# EAGLE design I2C-8574 (EAGLE 7.7.0)
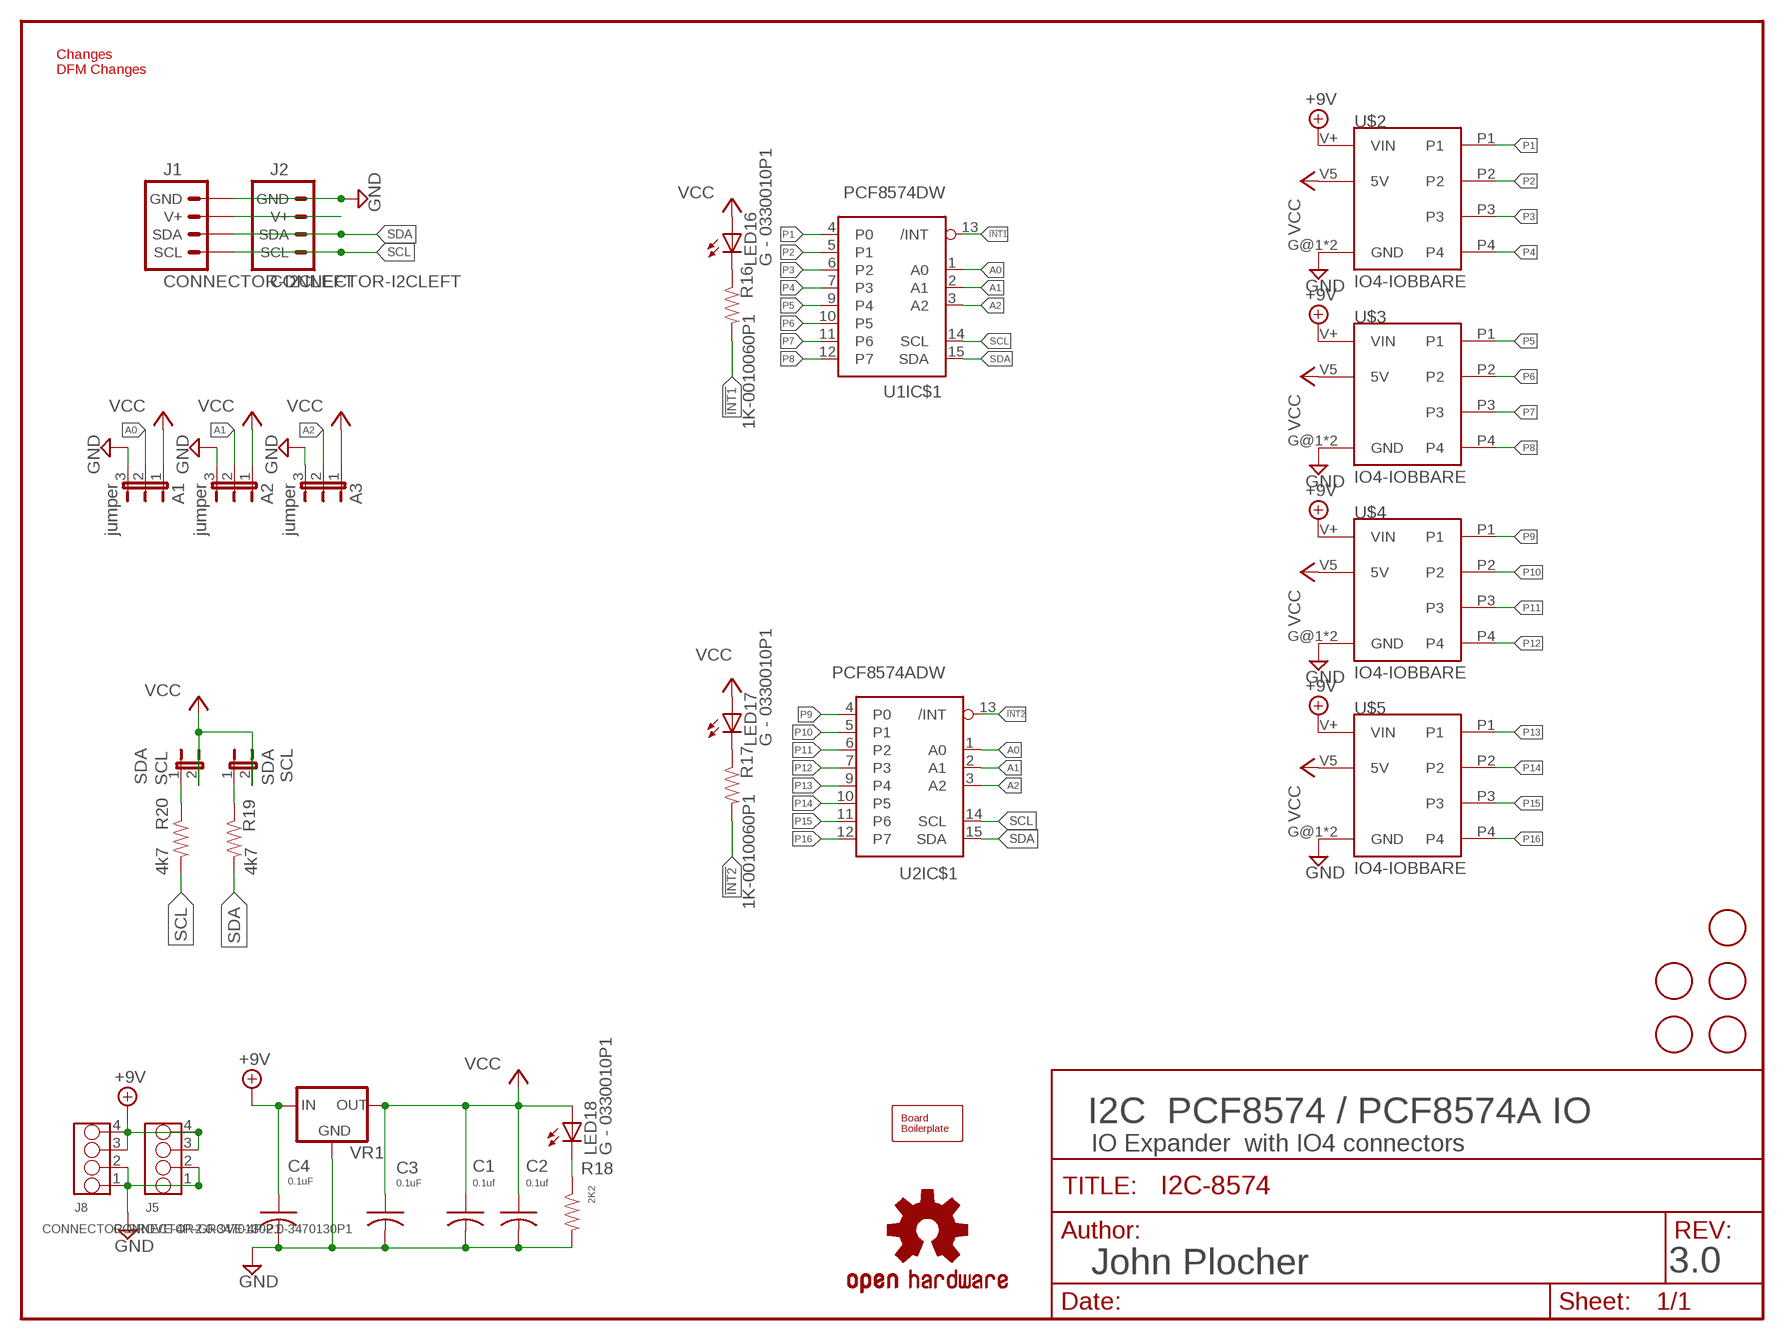
[diagram p0: schematic, sheet 1]

## Parts
A1  jumper  JUMPER-3PTH-LOCK  [1X03]
A2  jumper  JUMPER-3PTH-LOCK  [1X03]
A3  jumper  JUMPER-3PTH-LOCK  [1X03]
BOARD1  BOARD80X100-NOHOLES  [BOARD-DINRAIL-3.17IN-NOHOLES]
C1  0.1uf  C0805  [0805-CAP]
C2  0.1uf  C0805  [0805-CAP]
C3  0.1uF  C0805  [0805-CAP]
C4  0.1uF  C0805  [0805-CAP]
FID1  FIDUCIAL  [FIDUCIAL_1MM]
FID2  FIDUCIAL  [FIDUCIAL_1MM]
FID3  FIDUCIAL  [FIDUCIAL_1MM]
FID-U1  FIDUCIAL  [FIDUCIAL_1MM]
FID-U2  FIDUCIAL  [FIDUCIAL_1MM]
J1  CONNECTOR-I2CLEFT  [I2C-L]
J2  CONNECTOR-I2CLEFT  [I2C-L]
J5  CONNECTOR-GROVE-4P-2.0-3470130P1  [4P-2.0]
J8  CONNECTOR-GROVE-4P-2.0-3470130P1  [4P-2.0]
LED16  G - 0330010P1  LED0603-LED  [0603-LED]
LED17  G - 0330010P1  LED0603-LED  [0603-LED]
LED18  G - 0330010P1  LED0603-LED  [0603-LED]
R16  1K-0010060P1  R0805-RES  [0805-RES]
R17  1K-0010060P1  R0805-RES  [0805-RES]
R18  2K2  R0805-RES  [0805-RES]
R19  4k7  R0805-RES  [0805-RES]
R20  4k7  R0805-RES  [0805-RES]
SCL  SDA  JUMPER-2PTH_LOCK  [1X02_LOCK]
SDA  SCL  JUMPER-2PTH_LOCK  [1X02_LOCK]
U1  PCF8574DW  [SO-16DW]
U2  PCF8574ADW  [SO-16DW]
U$1  OSHW-LOGOL  [OSHW-LOGO-L]
U$2  IO4-IOBBARE  [IO4-IOB]
U$3  IO4-IOBBARE  [IO4-IOB]
U$4  IO4-IOBBARE  [IO4-IOB]
U$5  IO4-IOBBARE  [IO4-IOB]
VR1  VREG-DPAK-5  [TO-252]

## Nets
!INT1 [signals]: R16.2 U1.13(IC$1:/INT)
!INT2 [signals]: R17.2 U2.13(IC$1:/INT)
+9V [Power]: C4.1 J5.3 J5.4 J8.3 J8.4 U$2.V+(VIN) U$3.V+(VIN) U$4.V+(VIN) U$5.V+(VIN) VR1.1(IN)
A0 [signals]: A1.2 U1.1(IC$1:A0) U2.1(IC$1:A0)
A1 [signals]: A2.2 U1.2(IC$1:A1) U2.2(IC$1:A1)
A2 [signals]: A3.2 U1.3(IC$1:A2) U2.3(IC$1:A2)
GND [Power]: A1.3 A2.3 A3.3 C1.2 C2.2 C3.2 C4.2 J1.GND J1.GND@1(GND) J2.GND J2.GND@1(GND) J5.1 J5.2 J8.1 J8.2 R18.2 U$2.G@1(GND) U$2.G@2(GND) U$3.G@1(GND) U$3.G@2(GND) U$4.G@1(GND) U$4.G@2(GND) U$5.G@1(GND) U$5.G@2(GND) VR1.2(GND)
N$1: LED18.C R18.1
N$19 [signals]: R19.1 SCL.1
N$20 [signals]: R20.1 SDA.1
N$37: LED17.C R17.1
N$38: LED16.C R16.1
N$39: J1.V+ J1.V+@1(V+) J2.V+ J2.V+@1(V+)
P1 [signals]: U1.4(IC$1:P0) U$2.P1
P2 [signals]: U1.5(IC$1:P1) U$2.P2
P3 [signals]: U1.6(IC$1:P2) U$2.P3
P4 [signals]: U1.7(IC$1:P3) U$2.P4
P5 [signals]: U1.9(IC$1:P4) U$3.P1
P6 [signals]: U1.10(IC$1:P5) U$3.P2
P7 [signals]: U1.11(IC$1:P6) U$3.P3
P8 [signals]: U1.12(IC$1:P7) U$3.P4
P9 [signals]: U2.4(IC$1:P0) U$4.P1
P10 [signals]: U2.5(IC$1:P1) U$4.P2
P11 [signals]: U2.6(IC$1:P2) U$4.P3
P12 [signals]: U2.7(IC$1:P3) U$4.P4
P13 [signals]: U2.9(IC$1:P4) U$5.P1
P14 [signals]: U2.10(IC$1:P5) U$5.P2
P15 [signals]: U2.11(IC$1:P6) U$5.P3
P16 [signals]: U2.12(IC$1:P7) U$5.P4
SCL [signals]: J1.SCL J1.SCL@1(SCL) J2.SCL J2.SCL@1(SCL) R20.2 U1.14(IC$1:SCL) U2.14(IC$1:SCL)
SDA [signals]: J1.SDA J1.SDA@1(SDA) J2.SDA J2.SDA@1(SDA) R19.2 U1.15(IC$1:SDA) U2.15(IC$1:SDA)
VCC [Power]: A1.1 A2.1 A3.1 C1.1 C2.1 C3.1 LED16.A LED17.A LED18.A SCL.2 SDA.2 U$2.V5(5V) U$3.V5(5V) U$4.V5(5V) U$5.V5(5V) VR1.3(OUT)

## Notes on the sheet
- Changes
  DFM Changes
- I2C  PCF8574 / PCF8574A IO
- IO Expander  with IO4 connectors
- John Plocher | 3.0

## Power pins joined to a net without a drawn wire
GND: U1.8(PWR:GND) U2.8(PWR:GND)
VCC: U1.16(PWR:VCC) U2.16(PWR:VCC)

## Library data of the parts
A1-A3 = SPCoast-minimal:JUMPER-3
BOARD1 = SPCoast:BOARD
C1-C4 = SPCoast-minimal:C
FID1-FID3 FID-U1 FID-U2 = SPCoast:FIDUCIAL: For use by pick and place machines to calibrate the vision/machine, 1mm By microbuilder.eu
J1 J2 = SPCoast:CONNECTOR-I2C
J5 J8 = SPCoast:CONNECTOR-GROVE-4P-2.0
LED16-LED18 = SPCoast:LED*
R16-R18 = SPCoast-minimal:R*: Resistor Basic schematic elements and footprints for 0603, 1206, and PTH 1/10th watt (small) resistors.
R19 R20 = SPCoast:R*: Resistor Basic schematic elements and footprints for 0603, 1206, and PTH 1/10th watt (small) resistors.
SCL SDA = SPCoast-minimal:JUMPER-2: Jumper Basic 0.1" spaced jumper. Use with breakaway headers.
U1 U2 = SPCoast-minimal:PCF8574: Remote 8-Bit I/O Expander for I²C Bus
U$1 = SparkFun:OSHW-LOGO: Open Source Hardware Logo This logo indicates the piece of hardware it is found on incorporates a OSHW license and/or adheres to the definition of open source hardware found here: http://freedomdefined.org/OSHW
U$2-U$5 = SPCoast:IO4-IOB
VR1 = SPCoast:VREG-?-*: Voltage Regulator Standard linear regulator. 7805 uses IGO pinout LM1117 uses GOI pinout

## Net classes
0 default: width 0.254 mm, drill 0.5 mm
1 Power: width 0.406 mm, drill 0.6 mm
2 signals: width 0.254 mm, drill 0.5 mm

## Board
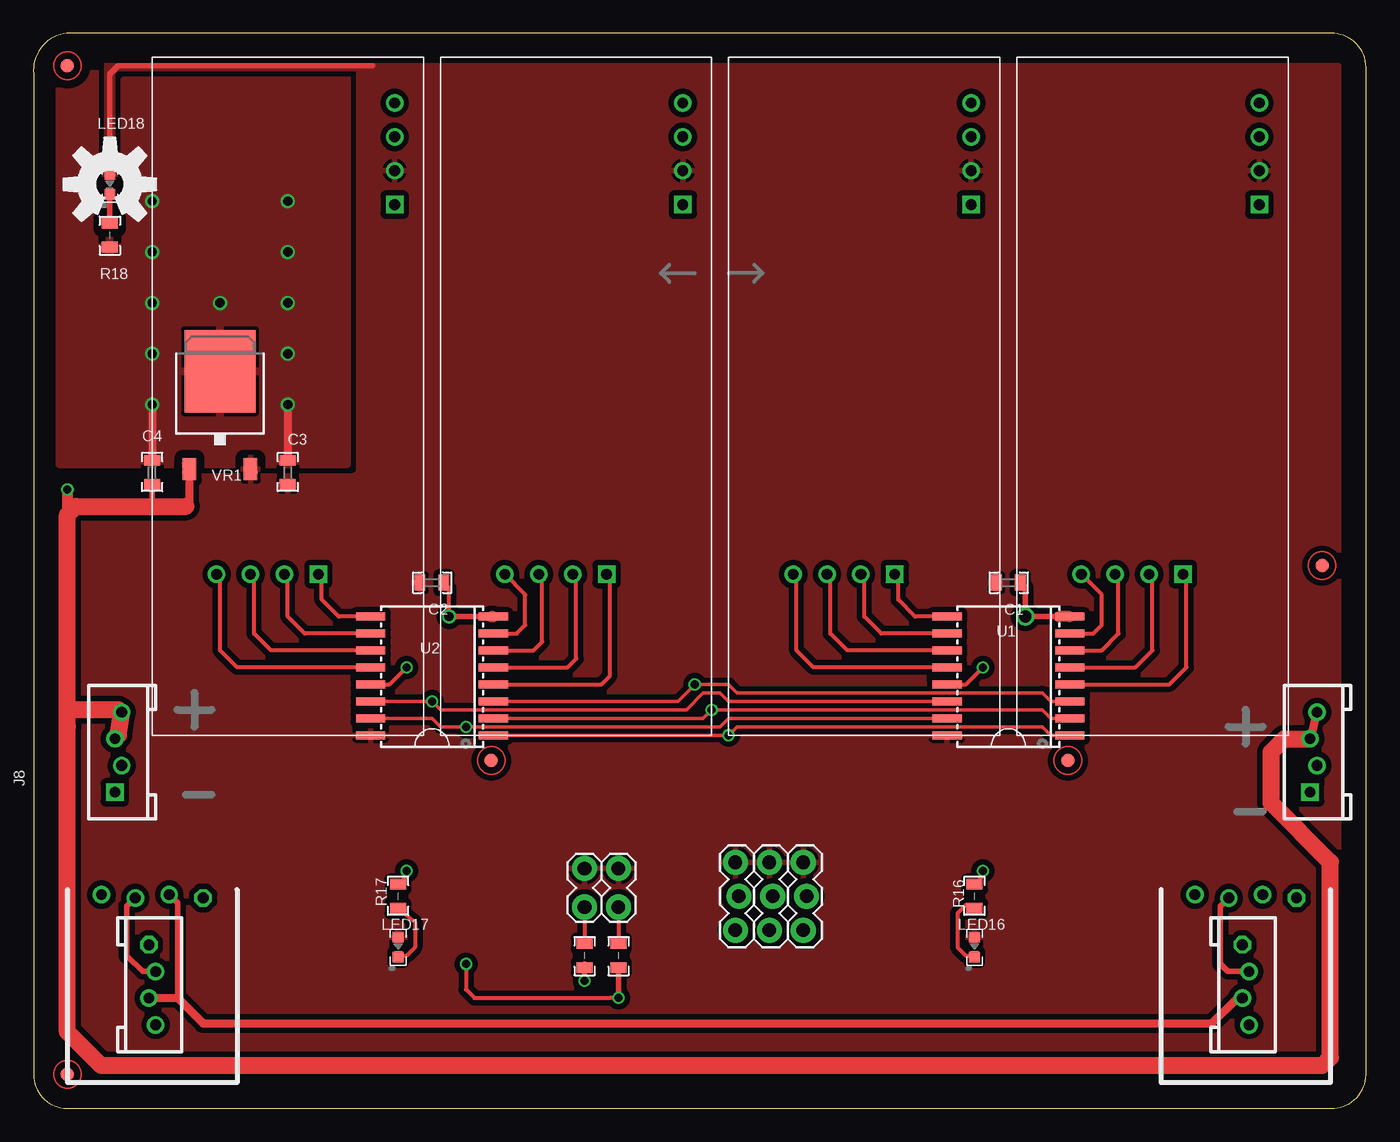
[diagram p1: board, top side]
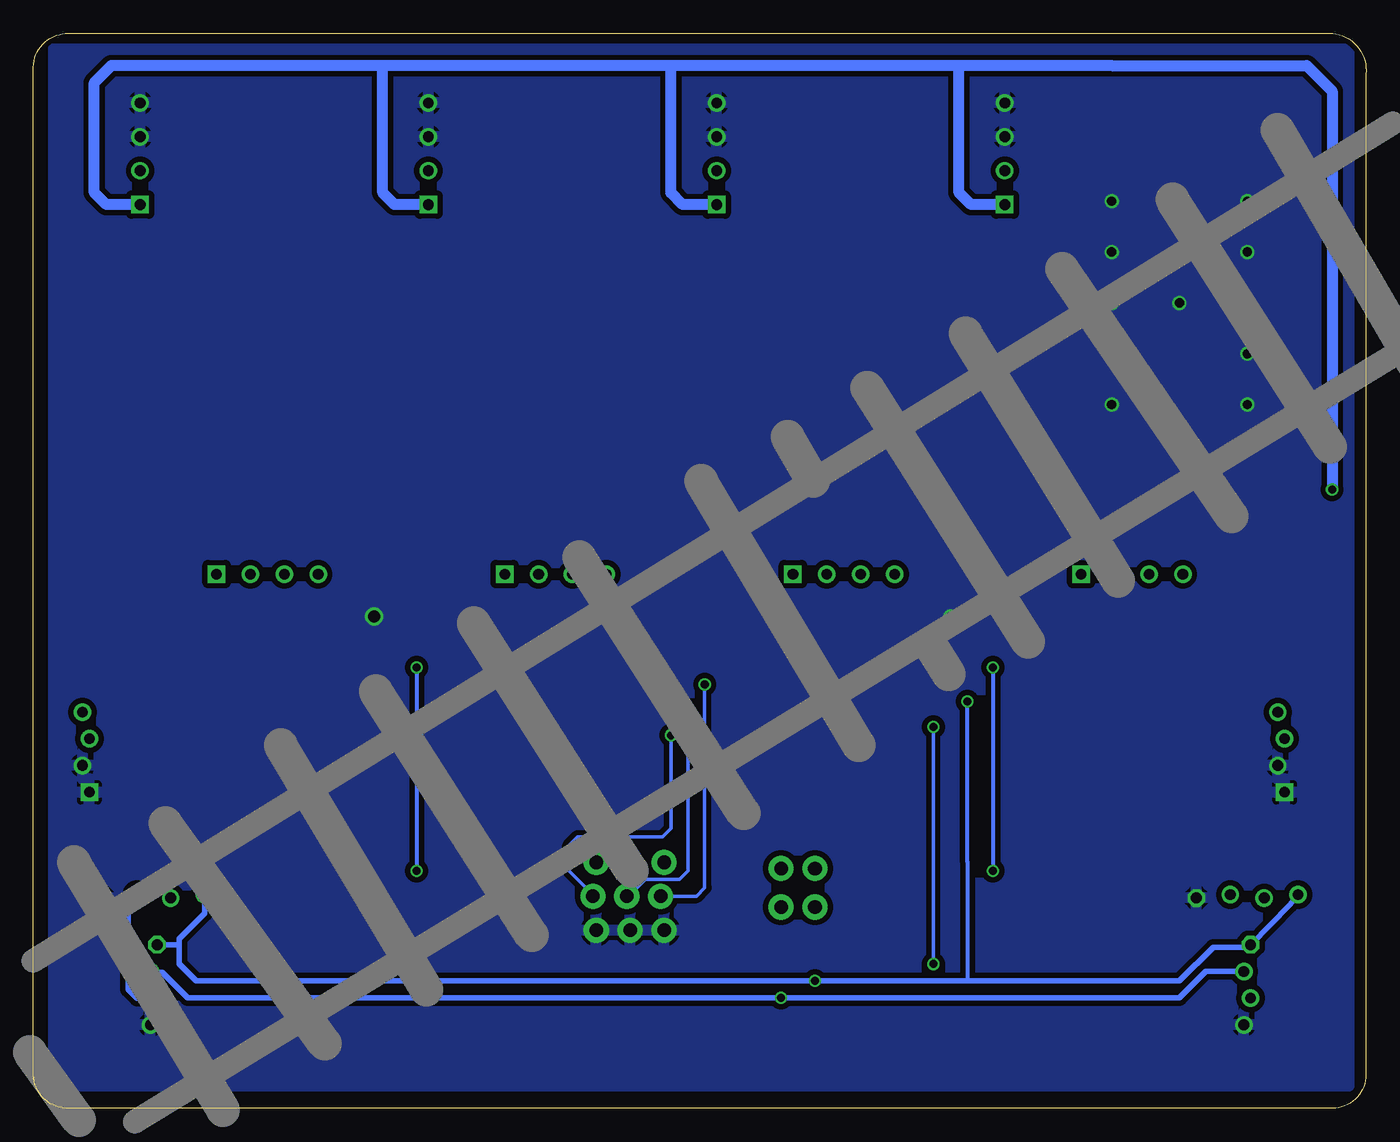
[diagram p2: board, bottom side, seen from below]

Size 99.84 x 80.52 mm. Coordinates in mm from the lower left corner, seen from the top.
Copper layers (1*16): Top 0.035mm / dielectric 1.5mm / Bottom 0.035mm
Design rules "Fusion_eagle_rule_v1.1": minimum track width 6mil, minimum drill 12mil, track to track 6mil, track to pad 6mil, pad to pad 6mil, via to via 6mil, smd to smd 0mil, copper to edge 10mil, drill to drill 10mil, minimum pad ring 10mil, minimum via ring 6mil, stop-mask expansion 2mil, vias tented up to drill 100mil, thermal gap 10mil

### Footprints (pad centres in the part's own frame; a part is rotated, then mirrored left to right if it is on the bottom)
1X03 = drill 1.016 pad 1.88: 1 0,-0.127; 2 2.54,0.127; 3 5.08,-0.127
0805-CAP = smd 0.8 x 1.2: 1 -0.9,0; 2 0.9,0
FIDUCIAL_1MM = smd 1 x 1: 1 0,0
I2C-L = drill 0.8 octagon: GND 3.81,-0.127 | drill 0.8 pad 1.27: GND@1 0.254,-9.635; SDA@1 0.254,-5.635; V+@1 -0.254,-7.635 | drill 0.8: SCL -3.81,0.127; SDA -1.27,-0.127; V+ 1.27,0.127 | drill 0.8 pad 1.27 octagon: SCL@1 -0.254,-3.635
4P-2.0 = drill 0.8 pad 1.27 square: 1 -3,0.254 | drill 0.8 pad 1.27: 2 -1,-0.254; 3 1,0.254; 4 3,-0.254
0603-LED = smd 0.8 x 0.8: A -0.75,0; C 0.75,0
0805-RES = smd 0.8 x 1.2: 1 -0.9,0; 2 0.9,0
1X02_LOCK = drill 1.016 pad 1.88: 1 -0.178,0; 2 2.718,0
SO-16DW = smd 0.6 x 2.2: 1 -4.445,-4.6; 2 -3.175,-4.6; 3 -1.905,-4.6; 4 -0.635,-4.6; 5 0.635,-4.6; 6 1.905,-4.6; 7 3.175,-4.6; 8 4.445,-4.6; 9 4.445,4.6; 10 3.175,4.6; 11 1.905,4.6; 12 0.635,4.6; 13 -0.635,4.6; 14 -1.905,4.6; 15 -3.175,4.6; 16 -4.445,4.6
IO4-IOB = drill 0.8: G@1 5.969,18.161; G@2 3.429,18.161; P2 38.735,9.906; P3 38.735,7.366; P4 38.735,4.826; V5 8.509,18.161 | drill 0.8 square: P1 38.735,12.446; V+ 11.049,18.161
TO-252 = smd 1.016 x 1.651: 1 -2.286,-4.826; 3 2.286,-4.826 | smd 5.3 x 6.2: 2 0,2.5

### Placement (x,y rotation side)
A1  57.8,18.41 270 top
A2  55.26,18.41 270 top
A3  52.72,18.41 270 top
BOARD1  0.01,0 0 top
C1  73.04,39.37 0 top
C2  29.86,39.37 0 top
C3  19.06,47.62 90 top
C4  8.9,47.62 90 top
FID1  2.55,78.11 0 top
FID2  2.55,2.54 0 top
FID3  96.53,40.64 0 top
FID-U1  77.48,26.04 0 top
FID-U2  34.3,26.04 0 top
J1  90.82,15.88 0 top
J2  8.9,15.88 0 top
J5  95.9,26.67 90 top
J8  6.36,26.67 90 top
LED16  70.5,12.06 270 top
LED17  27.32,12.06 270 top
LED18  5.73,69.22 270 top
R16  70.5,15.88 90 top
R17  27.32,15.88 90 top
R18  5.73,65.41 270 top
R19  43.83,11.43 270 top
R20  41.29,11.43 270 top
SCL  43.83,15.24 90 top
SDA  41.29,15.24 90 top
U1  73.04,32.38 90 top
U2  29.86,32.38 90 top
U$1  5.73,69.22 0 top
U$2  73.67,78.74 270 top
U$3  52.08,78.74 270 top
U$4  30.49,78.74 270 top
U$5  8.9,78.74 270 top
VR1  13.98,52.7 0 top

### Tracks (layer width: path | path; a pad name or v marks a point on that pad's centre or on a via)
!INT1  (via drill 0.6)
  Top 0.305: U1.13 69.86,31.75 v71.13,33.02 | R16.2 71.13,17.41 v71.13,17.78
  Bottom 0.305: v71.13,33.02 v71.13,17.78
!INT2  (via drill 0.6)
  Top 0.305: U2.13 26.68,31.75 v27.95,33.02 | R17.2 27.95,17.41 v27.95,17.78
  Bottom 0.305: v27.95,33.02 v27.95,17.78
+9V  (via drill 0.6)
  Top 0.305: 11.71,46.73 11.71,46.99
  Top 0.406: 11.71,46.99 11.71,47.87 VR1.1 | 11.44,45.09 11.71,45.35 | C4.1 8.9,45.09
  Top 0.61: 11.44,47.62 VR1.1 11.44,48.13 11.44,48.26 11.71,47.99 | J5.4 J5.3 | 11.71,45.35 11.71,46.99
  Top 0.813: v2.55,46.35 2.55,45.09 2.55,44.45
  Top 1.27: 2.55,29.84 6.36,29.84 J8.4 6.36,27.94 J8.3 | 2.55,29.84 2.55,28.57 2.55,5.71 5.09,3.17 96.53,3.17 97.17,3.81 97.17,18.41 92.72,22.86 92.72,26.67 93.72,27.67 J5.3 | 2.55,29.84 2.55,44.45 3.19,45.09 8.9,45.09 11.44,45.09
  Bottom 0.61: 19.7,78.11 19.06,78.11
  Bottom 0.813: 30.49,78.11 19.7,78.11 19.06,78.11 4.46,78.11 2.55,76.2 v2.55,46.35 | 30.49,78.11 33.03,78.11 52.08,78.11 | 52.08,78.11 53.99,78.11 73.67,78.11 | 73.67,78.11 78.12,78.11 93.99,78.11 95.26,76.83 95.26,68.58 94.37,67.69 U$2.V+ | U$5.V+ 29.6,67.69 30.49,68.58 30.49,78.11 | U$4.V+ 51.19,67.69 52.08,68.58 52.08,78.11 | U$3.V+ 72.78,67.69 73.67,68.58 73.67,78.11
A0  (via drill 0.6)
  Top 0.254: U2.1 v52.08,27.94 52.72,28.57 75.58,28.57 76.21,27.94 U1.1
  Bottom 0.254: A1.2 57.8,15.88 59.7,17.78 59.7,19.68 59.07,20.32 52.72,20.32 52.08,20.95 52.08,27.3 v52.08,27.94
A1  (via drill 0.6)
  Top 0.254: U2.2 50.18,29.21 v50.81,29.84 75.58,29.84 76.21,29.21 U1.2
  Bottom 0.254: A2.2 55.26,15.88 53.99,17.14 51.45,17.14 50.81,17.78 50.81,27.94 50.81,26.04 v50.81,29.84
A2  (via drill 0.6)
  Top 0.254: U2.3 48.27,30.48 v49.54,31.75 52.08,31.75 52.72,31.11 75.58,31.11 76.21,30.48 U1.3
  Bottom 0.254: A3.2 52.72,15.88 50.18,15.88 49.54,16.51 v49.54,31.75
GND  (via drill 0.7, 0.9)
  Top 0.305: v31.13,36.83 31.13,39 C2.2
  Top 0.406: 34.3,36.83 v31.13,36.83 | 76.85,36.83 v74.31,36.83 74.31,39 C1.2
  Top 0.61: v19.06,52.7 C3.2 | v8.9,52.7 C4.2
  Top 0.813: U2.8 34.3,36.83 | U1.8 76.85,36.83
  other vias: 8.9,56.52 19.06,56.52 8.9,60.33 19.06,60.33 13.98,60.33 19.06,64.14 8.9,64.14 8.9,67.94 19.06,67.94
  pour Bottom (isolate 0.406, rank 2): 98.31,1.65 98.31,79.38 1.28,79.38 1.28,1.65
  pour Top (isolate 0.61): 23.51,48.26 23.51,77.47 1.92,77.47 1.92,48.26
N$1
  Top 0.406: LED18.C R18.1
N$19
  Top 0.305: SCL.1 R19.1
N$20
  Top 0.305: SDA.1 R20.1
N$37
  Top 0.305: R17.1 28.59,13.97 28.59,12.06 27.95,11.43 LED17.C
N$38
  Top 0.305: R16.1 69.86,15.24 69.23,14.61 69.23,12.06 69.86,11.43 70.5,11.43 LED16.C
N$39
  Top 0.406: J2.V+ 10.81,15.37 10.81,8.26
  Top 0.61: J2.V+@1 8.66,8.26 10.81,8.26 12.08,6.99 12.71,6.35 88.28,6.35 90.17,8.24 J1.V+@1
  Bottom 0.406: J1.V+ 92.72,15.37 92.72,8.89 92.07,8.24 J1.V+@1
P1
  Top 0.305: U1.4 85.1,31.75 86.37,33.02 86.37,39.75 U$2.P1
P2
  Top 0.305: U1.5 82.56,33.02 83.83,34.29 83.83,39.75 U$2.P2
P3
  Top 0.305: U1.6 80.02,34.29 81.29,35.56 81.29,39.75 U$2.P3
P4
  Top 0.305: U1.7 79.39,35.56 80.02,36.2 80.02,38.48 U$2.P4
P5
  Top 0.305: U1.9 66.05,36.83 64.78,38.1 64.78,39.75 U$3.P1
P6
  Top 0.305: U1.10 63.51,35.56 62.24,36.83 62.24,39.75 U$3.P2
P7
  Top 0.305: U1.11 60.97,34.29 59.7,35.56 59.7,39.75 U$3.P3
P8
  Top 0.305: U1.12 58.43,33.02 57.16,34.29 57.16,39.75 U$3.P4
P9
  Top 0.305: U2.4 42.56,31.75 43.19,32.38 43.19,39.75 U$4.P1
P10
  Top 0.305: U2.5 40.02,33.02 40.65,33.66 40.65,39.75 U$4.P2
P11
  Top 0.305: U2.6 37.48,34.29 38.11,34.92 38.11,39.75 U$4.P3
P12
  Top 0.305: U2.7 36.21,35.56 36.84,36.2 36.84,38.48 U$4.P4
P13
  Top 0.305: U2.9 22.87,36.83 21.6,38.1 21.6,39.75 U$5.P1
P14
  Top 0.305: U2.10 20.33,35.56 19.06,36.83 19.06,39.75 U$5.P2
P15
  Top 0.305: U2.11 17.79,34.29 16.52,35.56 16.52,39.75 U$5.P3
P16
  Top 0.305: U2.12 15.25,33.02 13.98,34.29 13.98,39.75 U$5.P4
SCL  (via drill 0.6)
  Top 0.254: U2.14 v29.86,30.48 30.49,29.84 48.91,29.84 50.18,31.11 51.45,31.11 52.08,30.48 U1.14
  Top 0.406: v41.29,9.53 41.29,10.16 | 41.29,10.16 41.29,10.79 | R20.2 41.29,10.79 | 41.29,10.79 41.29,10.16
  Bottom 0.305: v29.86,30.48 29.86,18.41 29.86,9.53 30.49,9.53
  Bottom 0.406: J2.SCL 5.73,15.24 J2.SCL@1 8.82,12.06 11.44,12.06 13.98,9.53 30.49,9.53 v41.29,9.53 87.64,9.53 88.91,10.79 88.91,12.7 | 88.91,12.7 87.01,14.61 J1.SCL | J1.SCL@1 88.91,12.24 88.91,12.7
SDA  (via drill 0.6)
  Top 0.254: U2.15 29.86,29.21 30.49,28.57 v32.4,28.57 51.45,28.57 52.08,29.21 U1.15
  Top 0.305: v32.4,10.79 32.4,8.89 33.03,8.26 43.19,8.26 v43.83,8.26
  Top 0.406: R19.2 v43.83,8.26 | J2.SDA 7,15.11 7,11.43 8.19,10.24 J2.SDA@1 | J1.SDA 88.91,15.11 88.91,10.79 89.47,10.24 J1.SDA@1
  Bottom 0.254: v32.4,10.79 v32.4,28.57
  Bottom 0.406: J2.SDA@1 12,10.24 12.08,10.16 13.98,8.26 v43.83,8.26 88.28,8.26 90.18,10.16 90.99,10.16 J1.SDA@1
VCC
  Top 0.406: 25.41,78.11 6.36,78.11 5.73,77.47 LED18.A
  Top 0.61: 16.52,47.62 VR1.3
  Bottom 0.61: A3.1 52.72,18.41
  pour Top (isolate 0.406, rank 2): 97.8,1.27 97.8,78.11 1.92,78.11 1.92,1.27

### Text on the board
Document: External daughterboards for each IO bank / Eliminates having to custom cut 3M track / Eliminates having to stock signal driver I2C boards / Custom input low pass filters can be added to Detector and Turtle drivers
tDocu: v3.0 | gnd | gnd | gnd | gnd | Open Source | Hardware | gnd | gnd | gnd | gnd | 5v | 5v | 5v | 5v | Vin | Vin | Vin | Vin | I2C Address | Board Address | John Plocher | A2 A1 A0 | 7805 | B0: 0 0 0 0x38 0x20 | 2017.10 | B1: 0 0 1 0x39 0x21 | B2: 0 1 0 0x3A 0x22 | B3: 0 1 1 0x3B 0x23 | B4: 1 0 0 0x3C 0x24 | B5: 1 0 1 0x3D 0x25 | B6: 1 1 0 0x3E 0x26 | 16 bit I2C / Digital I/O / Active Low | B7: 1 1 1 0x3F 0x27 | I2C-8574 | I/O lines | I/O lines | I/O lines | I/O lines | 8 7 6 5 | 4 3 2 1 | 8 7 6 5 | 4 3 2 1 | '74 | '74A | Vin | PCF8574A | PCF8574 | 9 vDC | I2C Address | I2C Address | Vin | 9 vDC | 0 0 1 1 1 x x x | 0 0 1 0 0 x x x | 0x38-0x3F | Board / Address | 0x20-0x27 | 1 | I2C Term | 0 | A2 A1 A0 | Input Changed | Input Changed
bDocu: Made in the PCR, Coast Division, NMRA | I2C-8574-IO | Model Railroading is fun! | 16 bit (4x IO4 ports) / I2C digital I/O | Go Bears! | www. SP Coast .com | Active Low: | A "1" bit in the I/O register is associated with a LOW voltage on a pin